# Altium schematic sheet V2.SchDoc
size 546 x 495 mm; SheetNumber: 2; SheetTotal: 2
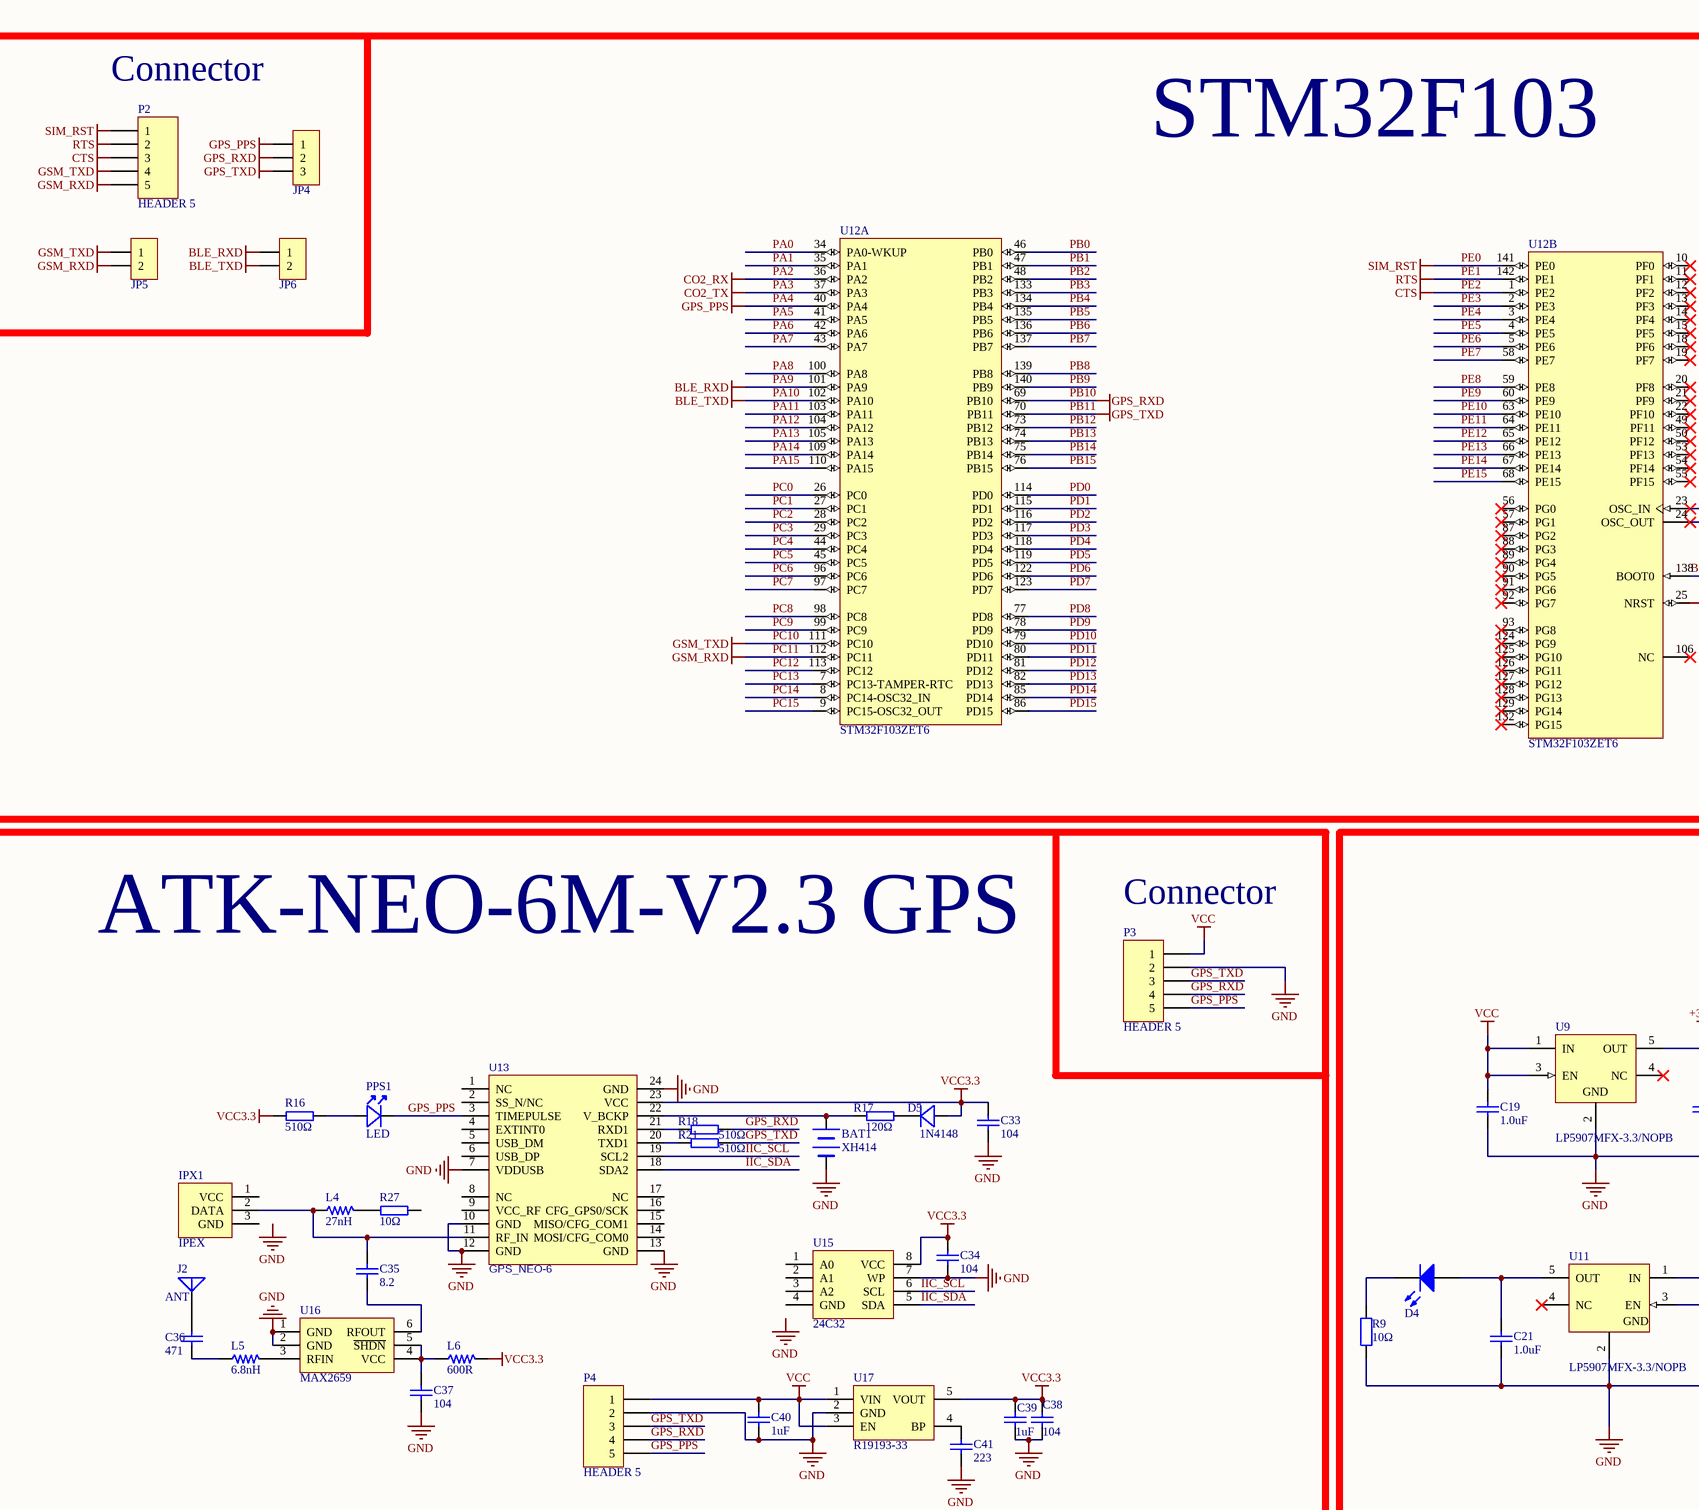
[diagram p0: V2.SchDoc, top left]
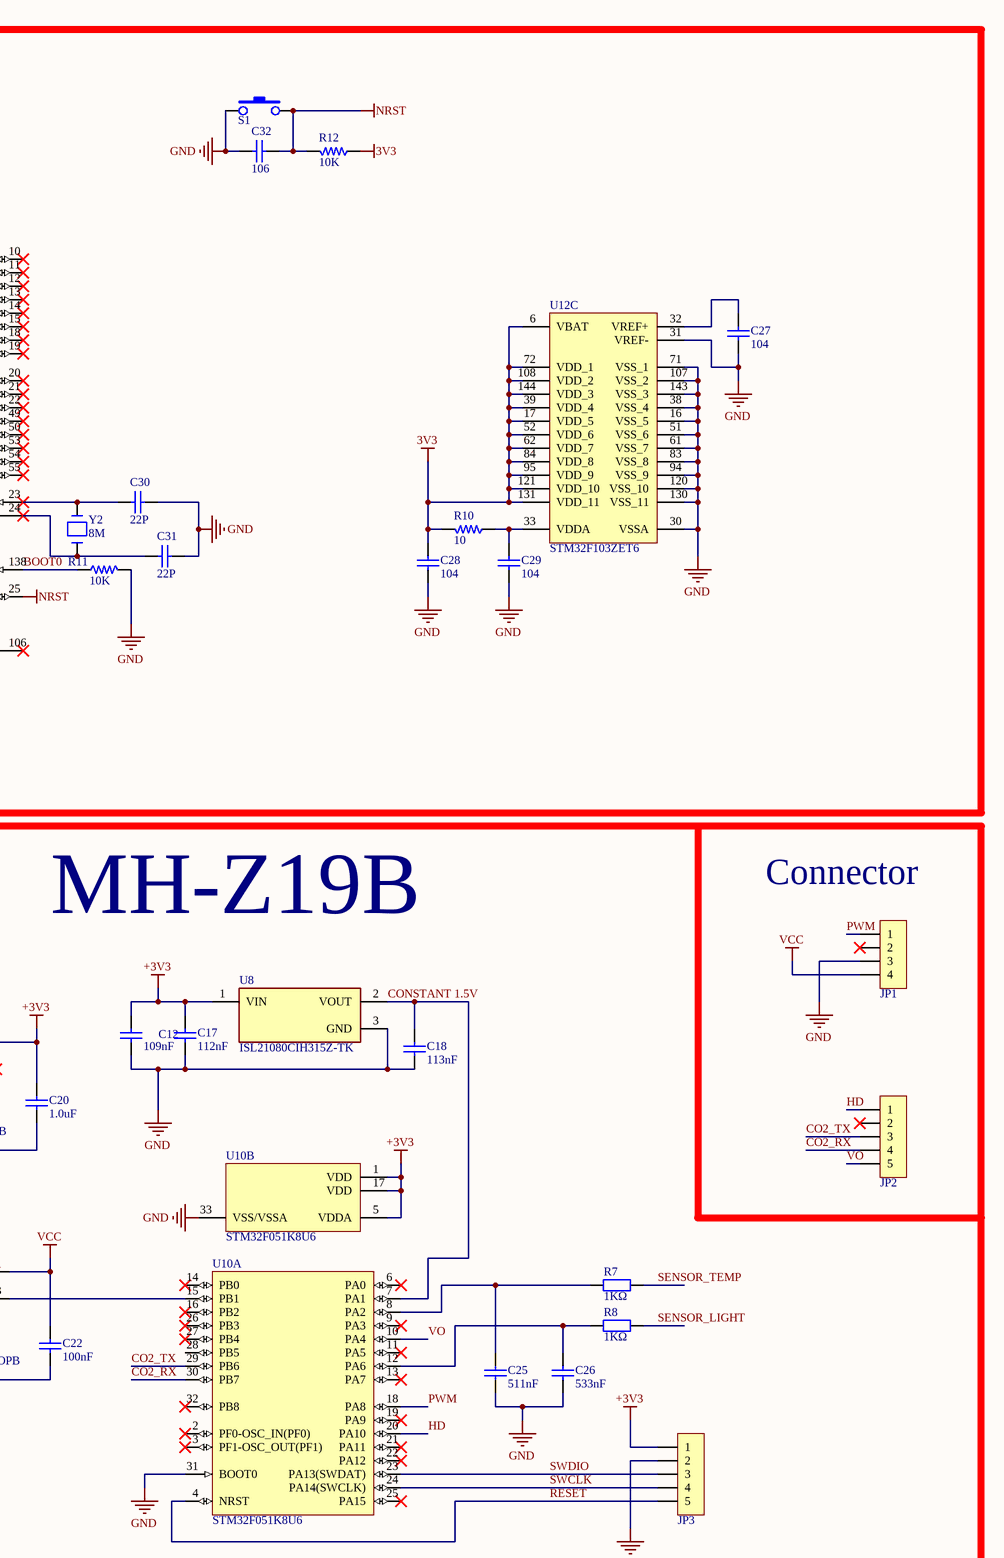
[diagram p1: V2.SchDoc, top right]
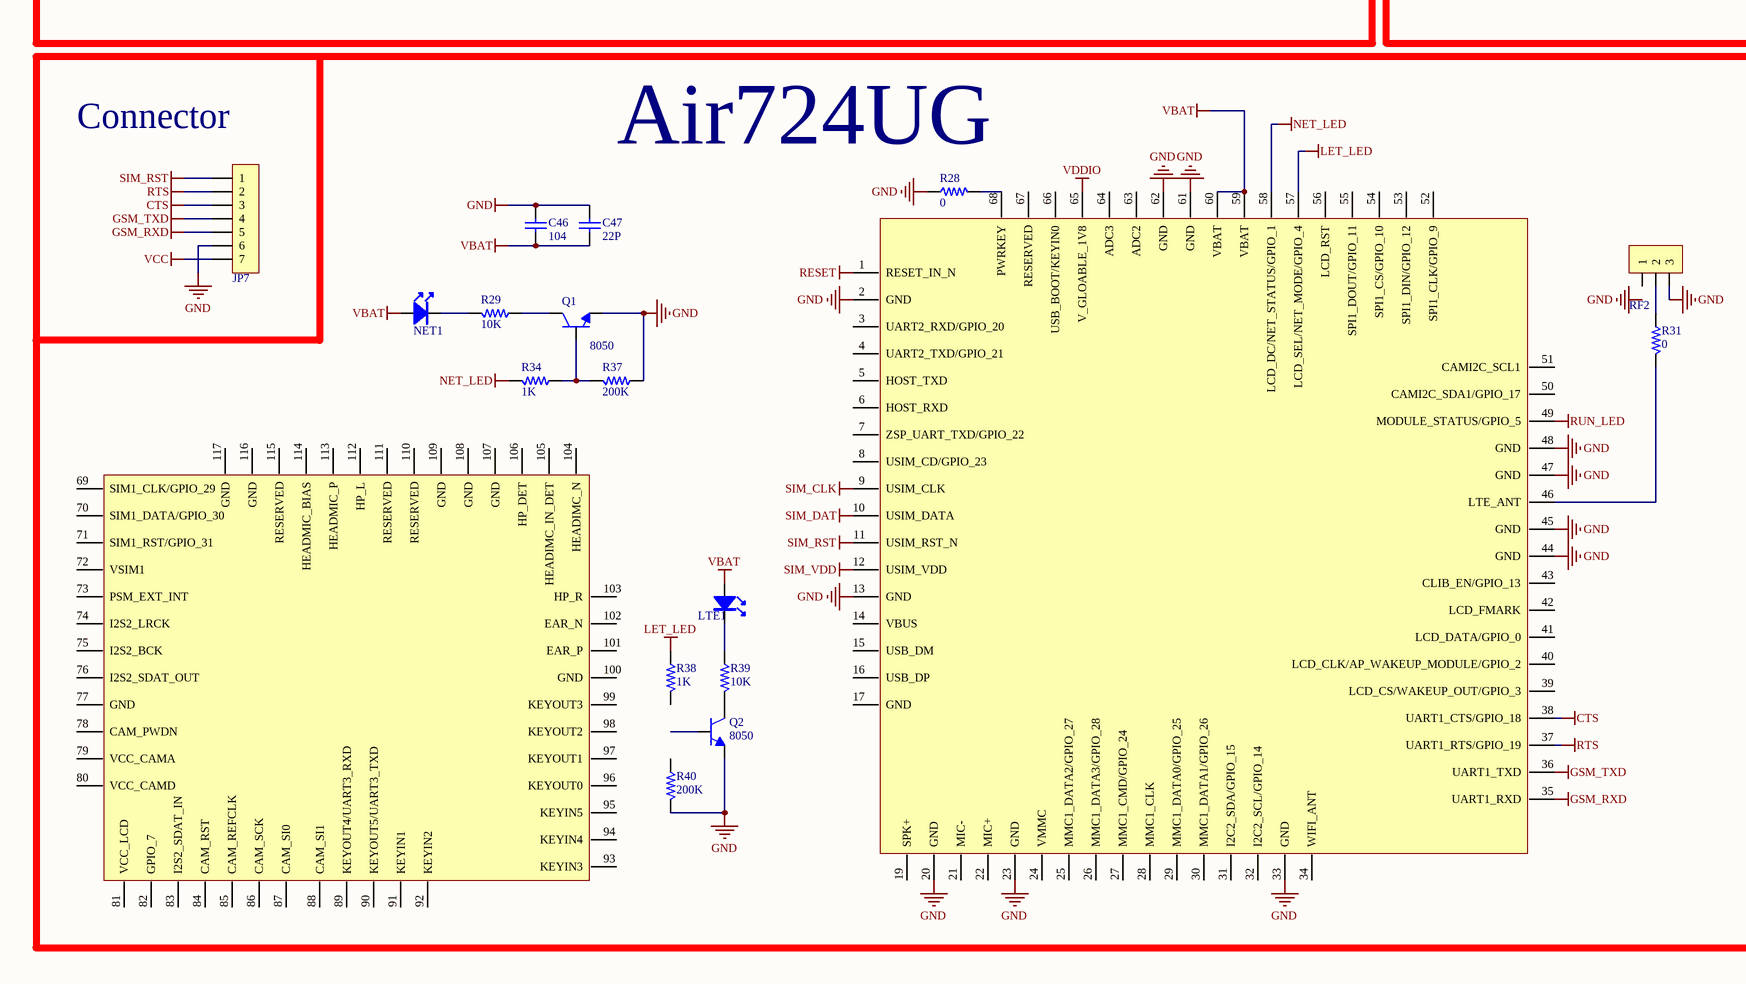
[diagram p2: V2.SchDoc, bottom left]
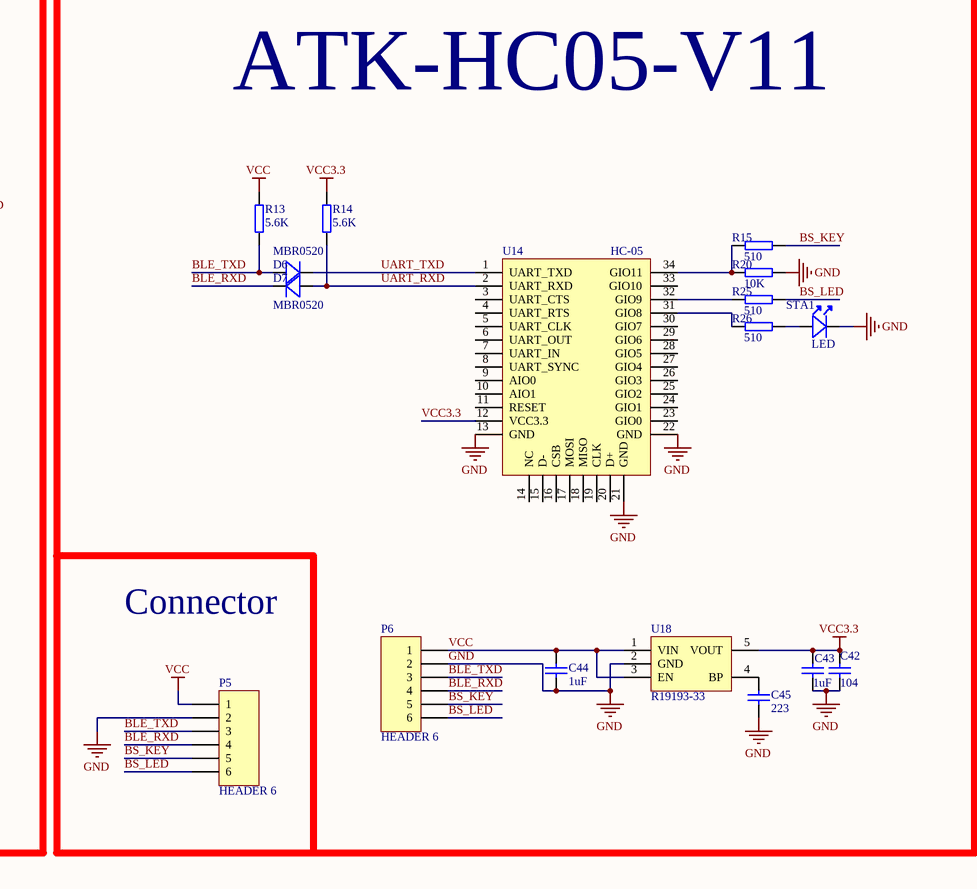
[diagram p3: V2.SchDoc, bottom right]

## Parts
BAT1  XH414  [SIP2]
C12  109nF  [0402_C]
C17  112nF  [0402_C]
C18  113nF  [0402_C]
C19  1.0uF  [0402_C]
C20  1.0uF  [0402_C]
C21  1.0uF  [0402_C]
C22  100nF  [0402_C]
C25  511nF  [0402_C]
C26  533nF  [0402_C]
C27  104  [RAD0.1]
C28  104  [RAD0.1]
C29  104  [RAD0.1]
C30  22P  [RAD0.1]
C31  22P  [RAD0.1]
C32  106  [RAD0.1]
C33  104  [RAD0.1]
C34  104  [RAD0.1]
C35  8.2  [RAD0.1]
C36  471  [RAD0.1]
C37  104  [RAD0.1]
C38  104  [RAD0.1]
C39  1uF  [RAD0.1]
C40  1uF  [RAD0.1]
C41  223  [RAD0.1]
C42  104  [RAD0.1]
C43  1uF  [RAD0.1]
C44  1uF  [RAD0.1]
C45  223  [RAD0.1]
C46  104  [RAD0.1]
C47  22P  [RAD0.1]
D4  LED  [LED_A1]  (value not drawn)
D5  1N4148  [DIODE0.4]
D6  MBR0520  [DIODE0.4]
D7  MBR0520  [DIODE0.4]
IPX1  IPEX  [SIP3]
J2  ANT  [SMA-5.08]
JP1  HDR-1X4  [XH2.54-WI-4P]  (value not drawn)
JP2  HDR-1X5  [XH2.54-WI-5P]  (value not drawn)
JP3  HDR-1X5  [XH2.54-WI-5P]  (value not drawn)
JP4  HDR-1X3  [XH2.54-WI-3P]  (value not drawn)
JP5  HDR-1X2  [XH2.54-WI-2P]  (value not drawn)
JP6  HDR-1X2  [XH2.54-WI-2P]  (value not drawn)
JP7  HDR-1X7  [XH2.54-WI-7P]  (value not drawn)
L4  27nH  [AXIAL0.4]
L5  6.8nH  [AXIAL0.4]
L6  600R  [AXIAL0.4]
LTE1  LED  [LED]  (value not drawn)
NET1  LED  [LED]  (value not drawn)
P2  HEADER 5  [SIP5]
P3  HEADER 5  [SIP5]
P4  HEADER 5  [SIP5]
P5  HEADER 6  [SIP6]
P6  HEADER 6  [SIP6]
PPS1  LED  [LED]
Q1  8050  [TO-92-EBC]
Q2  8050  [TO-92-EBC]
R7  1KΩ  [0402_R]
R8  1KΩ  [0402_R]
R9  10Ω  [0402_R]
R10  10  [AXIAL0.4]
R11  10K  [AXIAL0.4]
R12  10K  [AXIAL0.4]
R13  5.6K  [AXIAL0.4]
R14  5.6K  [AXIAL0.4]
R15  510  [AXIAL0.4]
R16  510Ω  [AXIAL0.4]
R17  120Ω  [AXIAL0.4]
R18  510Ω  [AXIAL0.4]
R20  10K  [AXIAL0.4]
R21  510Ω  [AXIAL0.4]
R25  510  [AXIAL0.4]
R26  510  [AXIAL0.4]
R27  10Ω  [AXIAL0.4]
R28  0  [AXIAL0.4]
R29  10K  [AXIAL0.4]
R31  0  [AXIAL0.4]
R34  1K  [AXIAL0.4]
R37  200K  [AXIAL0.4]
R38  1K  [AXIAL0.4]
R39  10K  [AXIAL0.4]
R40  200K  [AXIAL0.4]
RF2  CON3  [SIP3]  (value not drawn)
S1  SW-PB  [SW6X6]  (value not drawn)
STA1  LED  [LED]
U8  ISL21080CIH315Z-TK  [FP-P3_064A-IPC_A]
U9  LP5907MFX-3.3/NOPB  [DBV0005A_L]
U10  STM32F051K8U6  [STM-UFQFPN32_N]  (parts A,B of 2)
U11  LP5907MFX-3.3/NOPB  [DBV0005A_L]
U12  STM32F103ZET6  [STM-LQFP144_V]  (parts A,B,C of 3)
U13  GPS_NEO-6  [GPS_NEO-6]
U14  HC-05
U15  24C32  [DIP8]
U16  MAX2659
U17  R19193-33
U18  R19193-33
U19  Air724UG  [AIR724UG.1]  (value not drawn)  (parts A,B of 2)
Y2  8M  [XTAL1]

## Blocks framed on the sheet
STM32F103: C27-C32 JP4-JP6 P2 R10-R12 S1 U12 Y2
ATK-NEO-6M-V2.3 GPS: BAT1 C33-C41 D5 IPX1 J2 L4-L6 P3 P4 PPS1 R16-R18 R21 R27 U13 U15-U17
MH-Z19B: C12 C17-C22 C25 C26 D4 JP1-JP3 R7-R9 U8-U11
Air724UG: C46 C47 JP7 LTE1 NET1 Q1 Q2 R28 R29 R31 R34 R37-R40 RF2 U19
ATK-HC05-V11: C42-C45 D6 D7 P5 P6 R13-R15 R20 R25 R26 STA1 U14 U18

## Nets
3V3: C28.2 R10.2 R12.1 U12.6(VBAT) U12.17(VDD_5) U12.39(VDD_4) U12.52(VDD_6) U12.62(VDD_7) U12.72(VDD_1) U12.84(VDD_8) U12.95(VDD_9) U12.108(VDD_2) U12.121(VDD_10) U12.131(VDD_11) U12.144(VDD_3)
+3V3: C12.2 C17.2 C20.2 JP3.1 U8.1(VIN) U9.5(OUT) U10.1(VDD) U10.5(VDDA) U10.17(VDD)
BLE_RXD: D7.2(K) JP6.1 P5.4 P6.4 U12.101(PA9)  [also labelled PA9]
BLE_TXD: D6.1(A) JP6.2 P5.3 P6.3 R13.1 U12.102(PA10)  [also labelled PA10]
CO2_RX: JP2.4 U10.30(PB7) U12.36(PA2)  [also labelled PA2]
CO2_TX: JP2.3 U10.29(PB6) U12.37(PA3)  [also labelled PA3]
GND: BAT1.2(-) C12.1 C17.1 C18.1 C19.1 C20.1 C21.1 C22.1 C25.1 C26.1 C27.1 C28.1 C29.1 C30.2 C31.2 C32.2 C33.2 C34.2 C37.2 C38.2 C39.2 C40.2 C41.2 C42.2 C43.2 C44.2 C45.2 C46.1 C47.1 JP1.3 JP3.2 JP7.6 P3.2 P4.2 P5.2 P6.2 Q1.E Q2.E R9.1 R11.2 R20.1 R28.1 R37.1 R40.2 RF2.3 S1.1 STA1.2 U8.3(GND) U9.2(GND) U10.31(BOOT0) U10.33(VSS/VSSA) U11.2(GND) U12.16(VSS_5) U12.30(VSSA) U12.31(VREF-) U12.38(VSS_4) U12.51(VSS_6) U12.61(VSS_7) U12.71(VSS_1) U12.83(VSS_8) U12.94(VSS_9) U12.107(VSS_2) U12.120(VSS_10) U12.130(VSS_11) U12.143(VSS_3) U13.7(VDDUSB) U13.10(GND) U13.12(GND) U13.13(GND) U13.24(GND) U14.13(GND) U14.21(GND) U14.22(GND) U15.7(WP) U16.1(GND) U16.2(GND) U17.2(GND) U18.2(GND) U19.2(GND) U19.13(GND) U19.20(GND) U19.23(GND) U19.33(GND) U19.44(GND) U19.45(GND) U19.47(GND) U19.48(GND) U19.61(GND) U19.62(GND)
GPS_PPS: JP4.1 P3.5 P4.5 PPS1.2 U12.40(PA4) U13.3(TIMEPULSE)  [also labelled PA4]
GPS_RXD: JP4.2 P3.4 P4.4 R18.2 U12.69(PB10)  [also labelled PB10]
GPS_TXD: JP4.3 P3.3 P4.3 R21.2 U12.70(PB11)  [also labelled PB11]
LET_LED: R38.1 U19.57(LCD_SEL/NET_MODE/GPIO_4)
NET_LED: R34.2 U19.58(LCD_DC/NET_STATUS/GPIO_1)
NRST: C32.1 R12.2 S1.2 U12.25(NRST)
PC10: JP5.1 JP7.4 P2.4 U12.111(PC10) U19.36(UART1_TXD)  [also labelled GSM_TXD]
PC11: JP5.2 JP7.5 P2.5 U12.112(PC11) U19.35(UART1_RXD)  [also labelled GSM_RXD]
PE0: JP7.1 P2.1 U12.141(PE0) U19.11(USIM_RST_N)  [also labelled SIM_RST]
PE1: JP7.2 P2.2 U12.142(PE1) U19.37(UART1_RTS/GPIO_19)  [also labelled RTS]
PE2: JP7.3 P2.3 U12.1(PE2) U19.38(UART1_CTS/GPIO_18)  [also labelled CTS]
RESET: JP3.5 U10.4(NRST) U19.1(RESET_IN_N)
RUN_LED: U19.49(MODULE_STATUS/GPIO_5)
SIM_CLK: U19.9(USIM_CLK)
SIM_DAT: U19.10(USIM_DATA)
SIM_VDD: U19.12(USIM_VDD)
VBAT: C46.2 C47.2 LTE1.1 NET1.1 U19.59(VBAT) U19.60(VBAT)
VCC: C19.2 C22.2 C40.1 C44.1 JP1.4 JP7.7 P3.1 P4.1 P5.1 P6.1 R13.2 U9.1(IN) U9.3(EN) U11.1(IN) U17.1(VIN) U17.3(EN) U18.1(VIN) U18.3(EN)
VCC3.3: C33.1 C34.1 C38.1 C39.1 C42.1 C43.1 D5.1(A) L6.2 R14.2 R16.1 U13.23(VCC) U14.12(VCC3.3) U15.8(VCC) U17.5(VOUT) U18.5(VOUT)
VDDIO: U19.65(V_GLOABLE_1V8)
BOOT0: R11.1 U12.138(BOOT0)
BS_KEY: P5.5 P6.5 R15.1
BS_LED: P5.6 P6.6 R25.1
CONSTANT 1.5V: C18.2 U8.2(VOUT) U10.7(PA1)
HD: JP2.1 U10.20(PA10)
IIC_SCL: U13.19(SCL2) U15.6(SCL)
IIC_SDA: U13.18(SDA2) U15.5(SDA)
PA0: U12.34(PA0-WKUP)
PA1: U12.35(PA1)
PA5: U12.41(PA5)
PA6: U12.42(PA6)
PA7: U12.43(PA7)
PA8: U12.100(PA8)
PA11: U12.103(PA11)
PA12: U12.104(PA12)
PA13: U12.105(PA13)
PA14: U12.109(PA14)
PA15: U12.110(PA15)
PB0: U12.46(PB0)
PB1: U12.47(PB1)
PB2: U12.48(PB2)
PB3: U12.133(PB3)
PB4: U12.134(PB4)
PB5: U12.135(PB5)
PB6: U12.136(PB6)
PB7: U12.137(PB7)
PB8: U12.139(PB8)
PB9: U12.140(PB9)
PB12: U12.73(PB12)
PB13: U12.74(PB13)
PB14: U12.75(PB14)
PB15: U12.76(PB15)
PC0: U12.26(PC0)
PC1: U12.27(PC1)
PC2: U12.28(PC2)
PC3: U12.29(PC3)
PC4: U12.44(PC4)
PC5: U12.45(PC5)
PC6: U12.96(PC6)
PC7: U12.97(PC7)
PC8: U12.98(PC8)
PC9: U12.99(PC9)
PC12: U12.113(PC12)
PC13: U12.7(PC13-TAMPER-RTC)
PC14: U12.8(PC14-OSC32_IN)
PC15: U12.9(PC15-OSC32_OUT)
PD0: U12.114(PD0)
PD1: U12.115(PD1)
PD2: U12.116(PD2)
PD3: U12.117(PD3)
PD4: U12.118(PD4)
PD5: U12.119(PD5)
PD6: U12.122(PD6)
PD7: U12.123(PD7)
PD8: U12.77(PD8)
PD9: U12.78(PD9)
PD10: U12.79(PD10)
PD11: U12.80(PD11)
PD12: U12.81(PD12)
PD13: U12.82(PD13)
PD14: U12.85(PD14)
PD15: U12.86(PD15)
PE3: U12.2(PE3)
PE4: U12.3(PE4)
PE5: U12.4(PE5)
PE6: U12.5(PE6)
PE7: U12.58(PE7)
PE8: U12.59(PE8)
PE9: U12.60(PE9)
PE10: U12.63(PE10)
PE11: U12.64(PE11)
PE12: U12.65(PE12)
PE13: U12.66(PE13)
PE14: U12.67(PE14)
PE15: U12.68(PE15)
PWM: JP1.1 U10.18(PA8)
SENSOR_LIGHT: R8.2
SENSOR_TEMP: R7.2
SWCLK: JP3.4 U10.24(PA14(SWCLK))
SWDIO: JP3.3 U10.23(PA13(SWDAT))
UART_RXD: D7.1(A) R14.1 U14.2(UART_RXD)
UART_TXD: D6.2(K) U14.1(UART_TXD)
VO: JP2.5 U10.10(PA4)
NetBAT1_1: BAT1.1(+) R17.1 U13.22(V_BCKP)
NetC21_2: C21.2 D4.1(A) U11.5(OUT)
NetC25_2: C25.2 R7.1 U10.8(PA2)
NetC26_2: C26.2 R8.1 U10.12(PA6)
NetC27_2: C27.2 U12.32(VREF+)
NetC29_2: C29.2 R10.1 U12.33(VDDA)
NetC30_1: C30.1 U12.23(OSC_IN) Y2.2
NetC31_1: C31.1 U12.24(OSC_OUT) Y2.1
NetC35_1: C35.1 IPX1.2(DATA) L4.1 U13.11(RF_IN)
NetC35_2: C35.2 U16.6(RFOUT)
NetC36_1: C36.1 J2.1(A)
NetC36_2: C36.2 L5.1
NetC37_1: C37.1 L6.1 U16.4(VCC) U16.5(~{SHDN})
NetC41_1: C41.1 U17.4(BP)
NetC45_1: C45.1 U18.4(BP)
NetD4_2: D4.2(K) R9.2
NetD5_2: D5.2(K) R17.2
NetL4_2: L4.2 R27.1
NetL5_2: L5.2 U16.3(RFIN)
NetLTE1_2: LTE1.2 R39.1
NetNET1_2: NET1.2 R29.2
NetPPS1_1: PPS1.1 R16.2
NetQ1_B: Q1.B R34.1 R37.2
NetQ1_C: Q1.C R29.1
NetQ2_C: Q2.C R39.2
NetR15_2: R15.2 R20.2 U14.34(GIO11)
NetR18_1: R18.1 U13.21(RXD1)
NetR21_1: R21.1 U13.20(TXD1)
NetR25_2: R25.2 U14.32(GIO9)
NetR26_1: R26.1 STA1.1
NetR26_2: R26.2 U14.31(GIO8)
NetR28_2: R28.2 U19.68(PWRKEY)
NetR31_1: R31.1 RF2.2
NetR31_2: R31.2 U19.46(LTE_ANT)
NetU10_15: U10.15(PB1) U11.3(EN)

Not connected (* = marked no-connect by the designer): IPX1 1(VCC) 3(GND); JP1 2*; JP2 2*; Q2 B; R27 2; R38 2; R40 1; RF2 1; U9 4(NC)*; U10 2(PF0-OSC_IN(PF0))* 3(PF1-OSC_OUT(PF1))* 6(PA0)* 9(PA3)* 11(PA5)* 13(PA7)* 14(PB0)* 16(PB2)* 19(PA9)* 21(PA11)* 22(PA12)* 25(PA15)* 26(PB3)* 27(PB4)* 28(PB5) 32(PB8)*; U11 4(NC)*; U12 10(PF0)* 11(PF1)* 12(PF2)* 13(PF3)* 14(PF4)* 15(PF5)* 18(PF6)* 19(PF7)* 20(PF8)* 21(PF9)* 22(PF10)* 49(PF11)* 50(PF12)* 53(PF13)* 54(PF14)* 55(PF15)* 56(PG0)* 57(PG1)* 87(PG2)* 88(PG3)* 89(PG4)* 90(PG5)* 91(PG6)* 92(PG7)* 93(PG8)* 106(NC)* 124(PG9)* 125(PG10)* 126(PG11)* 127(PG12)* 128(PG13)* 129(PG14)* 132(PG15)*; U13 1(NC) 2(SS_N/NC) 4(EXTINT0) 5(USB_DM) 6(USB_DP) 8(NC) 9(VCC_RF) 14(MOSI/CFG_COM0) 15(MISO/CFG_COM1) 16(CFG_GPS0/SCK) 17(NC); U14 3(UART_CTS) 4(UART_RTS) 5(UART_CLK) 6(UART_OUT) 7(UART_IN) 8(UART_SYNC) 9(AIO0) 10(AIO1) 11(RESET) 14(NC) 15(D-) 16(CSB) 17(MOSI) 18(MISO) 19(CLK) 20(D+) 23(GIO0) 24(GIO1) 25(GIO2) 26(GIO3) 27(GIO4) 28(GIO5) 29(GIO6) 30(GIO7) 33(GIO10); U15 1(A0) 2(A1) 3(A2) 4(GND); U19 3(UART2_RXD/GPIO_20) 4(UART2_TXD/GPIO_21) 5(HOST_TXD) 6(HOST_RXD) 7(ZSP_UART_TXD/GPIO_22) 8(USIM_CD/GPIO_23) 14(VBUS) 15(USB_DM) 16(USB_DP) 17(GND) 19(SPK+) 21(MIC-) 22(MIC+) 24(VMMC) 25(MMC1_DATA2/GPIO_27) 26(MMC1_DATA3/GPIO_28) 27(MMC1_CMD/GPIO_24) 28(MMC1_CLK) 29(MMC1_DATA0/GPIO_25) 30(MMC1_DATA1/GPIO_26) 31(I2C2_SDA/GPIO_15) 32(I2C2_SCL/GPIO_14) 34(WIFI_ANT) 39(LCD_CS/WAKEUP_OUT/GPIO_3) 40(LCD_CLK/AP_WAKEUP_MODULE/GPIO_2) 41(LCD_DATA/GPIO_0) 42(LCD_FMARK) 43(CLIB_EN/GPIO_13) 50(CAMI2C_SDA1/GPIO_17) 51(CAMI2C_SCL1) 52(SPI1_CLK/GPIO_9) 53(SPI1_DIN/GPIO_12) 54(SPI1_CS/GPIO_10) 55(SPI1_DOUT/GPIO_11) 56(LCD_RST) 63(ADC2) 64(ADC3) 66(USB_BOOT/KEYIN0) 67(RESERVED) 69(SIM1_CLK/GPIO_29) 70(SIM1_DATA/GPIO_30) 71(SIM1_RST/GPIO_31) 72(VSIM1) 73(PSM_EXT_INT) 74(I2S2_LRCK) 75(I2S2_BCK) 76(I2S2_SDAT_OUT) 77(GND) 78(CAM_PWDN) 79(VCC_CAMA) 80(VCC_CAMD) 81(VCC_LCD) 82(GPIO_7) 83(I2S2_SDAT_IN) 84(CAM_RST) 85(CAM_REFCLK) 86(CAM_SCK) 87(CAM_SI0) 88(CAM_SI1) 89(KEYOUT4/UART3_RXD) 90(KEYOUT5/UART3_TXD) 91(KEYIN1) 92(KEYIN2) 93(KEYIN3) 94(KEYIN4) 95(KEYIN5) 96(KEYOUT0) 97(KEYOUT1) 98(KEYOUT2) 99(KEYOUT3) 100(GND) 101(EAR_P) 102(EAR_N) 103(HP_R) 104(HEADIMC_N) 105(HEADIMC_IN_DET) 106(HP_DET) 107(GND) 108(GND) 109(GND) 110(RESERVED) 111(RESERVED) 112(HP_L) 113(HEADMIC_P) 114(HEADMIC_BIAS) 115(RESERVED) 116(GND) 117(GND)

## Notes on the sheet
- Connector
- (near P3) Connector
- (near JP1) Connector
- (near JP7) Connector
- Labels drawn without touching a wire or pin: GND

## Library data of the parts
BAT1 = BATTERY
C12 C17 C18 C25 C26 = 0402 1nF (102) 10% 50V: 贴片电容; ComponentLink1Description: 供应商链接; ComponentLink1URL: http://www.szlcsc.com/product/details_1875.html; Package: 0402; Supplier: LC; SuppliersPartNumber: C1523
C19-C22 = 0402 1.0uF (105) 10% 25V: 贴片电容; ComponentLink1Description: 供应商链接; ComponentLink1URL: http://www.szlcsc.com/product/details_53938.html; Package: 0402; Supplier: LC; SuppliersPartNumber: C52923
C27-C47 = CAP: Capacitor
D4 = LED: 发光二极管; 技术支持，联系售后: https://shop463601444.taobao.com
D5-D7 = DIODE2: Diode
IPX1 = DHT22: 温湿度模块
J2 = ANTENNA: Generic Antenna
JP1 = Header 4: 4P接插件; 版权归属: 封装库来自淘宝 ID：黄晶宝石; BOM名称: 4P接插件; 学习资源: https://shop463601444.taobao.com
JP2 JP3 = Header 5: 5P接插件; 版权归属: 封装库来自淘宝 ID：黄晶宝石; BOM名称: 5P接插件; 学习资源: https://shop463601444.taobao.com
JP4 = Header 3: 3P接插件; 版权归属: 封装库来自淘宝 ID：黄晶宝石; BOM名称: 3P接插件; 学习资源: https://shop463601444.taobao.com
JP5 JP6 = Header 2: 2P接插件; 版权归属: 封装库来自淘宝 ID：黄晶宝石; BOM名称: 2P接插件; 联系售后: https://shop463601444.taobao.com
JP7 = Header 7: 7P接插件; 版权归属: 封装库来自淘宝 ID：黄晶宝石; BOM名称: 7P接插件; 学习资源: https://shop463601444.taobao.com
L4-L6 R10-R12 R28 R29 R31 R34 R37-R40 = RES3: Ω
PPS1 STA1 = LED2
Q1 Q2 = NPN1: 9013,9014,9018,8050,2N3904
R7 R8 = 0402 1KΩ (1001) 1%: 贴片电阻; ComponentLink1Description: 供应商链接; ComponentLink1URL: http://www.szlcsc.com/product/details_12256.html; Package: 0402; Supplier: LC; SuppliersPartNumber: C11702
R9 = 0402 0Ω (0R0) 1%: 贴片电阻; ComponentLink1Description: 供应商链接; ComponentLink1URL: http://www.szlcsc.com/product/details_17853.html; Package: 0402; Supplier: LC; SuppliersPartNumber: C17168
R13-R18 R20 R21 R25-R27 = RES2: Ω
RF2 = CON3: Connector
U8 = CMP-13559-000003-1: IC VREF SERIES 0.5% SOT23-3; RoHS Compliant: Yes
U9 U11 = CMP-2000-07464-1: Ultra-Low-Noise, Low-IQ LDO, 0.25 A, Fixed 3.3 V Output, 2.2 to 5.5 V Input, -40 to 125 degC, 5-Pin SOT-23 (DBV), Green (RoHS & no Sb/Br), Tape and Reel; Manufacturer: Texas Instruments; Max Output Current: 250mA; Max Input Voltage: 5.5V; Dropout Voltage: 250mV; Number of Regulators: 1; Nominal Output Voltage: 3.3V; Output Voltage Accuracy: 2%; Polarity: Positive; Min Input Voltage: 2.2V; Package Version: 4073253-4/N, 12/2014; Quiescent Current: 425uA; Power Supply Rejection Ratio (PSRR): 82dB; Case\/Package: SOT-23; Lead Free: LeadFree; Package Reference: DBV5; Output Current: 250mA; Package Description: 5-Pin Small Outline Transistor, Body 2.9 x 1.6 mm, Pitch 0.95 mm; Max Operating Temperature: 125degC; Mounting Technology: SurfaceMount; Number of Pins: 5; Mount: SurfaceMount; Manufacturer URL: http://www.ti.com/; Accuracy: 2%; Package URL: http://www.ti.com/lit/ml/mpds018l/mpds018l.pdf; Output Voltage: 3.3V; Radiation Hardening: No; Number of Outputs: 1; Packaging: TapeandReel; RoHSCompliant: true; Min Operating Temperature: -40degC; Datasheet URL: http://www.ti.com/lit/ds/symlink/lp5907.pdf; Package Quantity: 3000; Datasheet Version: Rev. L, 09/2016; REACH SVHC: NoSVHC; Contact Plating: Tin
U10 = CMP-0304-00002-3: ARM Cortex-M0 32-bit MCU, 64 KB Flash, 8 KB Internal RAM, 27 I/Os, 32-pin UFQFPN, -40 to 85 degC, Tray; Internal RAM Size (kB): 8; Operating Frequency(F) (Processor speed) (MHz): 48; Supply Voltage(Vcc) min (V): 2; I/Os (High Current): 27; FLASH Size (Prog) (kB): 64; ComponentLink2URL: http://www.st.com/st-web-ui/static/active/en/resource/technical/document/datasheet/DM00039193.pdf; ComponentLink3Description: Package Specification; DatasheetVersion: Rev. 3; ComponentLink1Description: Manufacturer URL; PackageVersion: Rev. 3, 07/2012; PackageDescription: 32-Pin Ultra Thin Fine Pitch Quad Flat No-Lead, 5 x 5 x 0.6 mm Body, 0.5 mm Pitch, Exposed Pad; ComponentLink3URL: http://www.st.com/st-web-ui/static/active/en/resource/technical/document/datasheet/DM00039193.pdf; PackageReference: UFQFPN32; Packing: Tray; PartNumber: STM32F051K8U6; Core: ARM Cortex-M0; Mounting Technology: Surface Mount; ComponentLink2Description: Datasheet; ComponentLink1URL: http://www.st.com/web/en/home.html
U12 = CMP-0237-00176-3: ARM Cortex-M3 32-bit MCU, 512 KB Flash, 64 KB Internal RAM, 112 I/Os, 144-pin LQFP, -40 to 85 degC, Tray; D/A Converter: 2x12-bit (2 Channel); FLASH Size (Prog) (kB): 512; Internal RAM Size (kB): 64; I/Os (High Current): 112; Supply Voltage(Vcc) min (V): 2; Operating Frequency(F) (Processor speed) (MHz): 72; A/D Converter: 3x12-bit (21 Channel); ComponentLink2Description: Datasheet; PackageReference: LQFP144; ComponentLink3URL: http://www.st.com/st-web-ui/static/active/en/resource/technical/document/datasheet/DM00037051.pdf; Mounting Technology: Surface Mount; ComponentLink1URL: http://www.st.com/web/en/home.html; ComponentLink2URL: http://www.st.com/st-web-ui/static/active/en/resource/technical/document/datasheet/CD00191185.pdf; PackageVersion: Rev. 4, 06/2013; DatasheetVersion: Rev. 8; PartNumber: STM32F103ZET6; ComponentLink1Description: Manufacturer URL; PackageDescription: 144-Pin Low Profile Quad Flat Package, 20 x 20 mm Body, 0.5 mm Pitch; Core: ARM Cortex-M3; ComponentLink3Description: Package Specification; Packing: Tray
U13 = GPS_NEO-6: Contributor: dyf666; spicePre: U; spiceSymbolName: GPS_NEO-6
U14 = HC-05: 蓝牙模块
U19 = Air724UG: subpart_no: 1; Contributor: willa_111; spicePre: U; spiceSymbolName: Air724UG
Y2 = XTAL